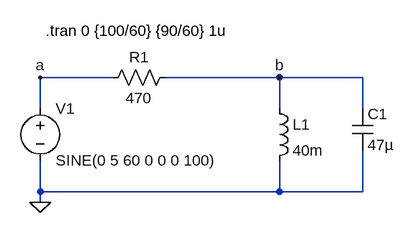
[diagram p0: schematic RLC.asc]
RLC.asc, the LTspice schematic file:
Version 4
SHEET 1 880 680
WIRE 128 64 16 64
WIRE 384 64 208 64
WIRE 512 64 384 64
WIRE 16 112 16 64
WIRE 384 112 384 64
WIRE 512 112 512 64
WIRE 16 240 16 192
WIRE 384 240 384 192
WIRE 384 240 16 240
WIRE 512 240 512 176
WIRE 512 240 384 240
WIRE 16 256 16 240
FLAG 16 64 a
FLAG 384 64 b
FLAG 16 256 0
SYMBOL voltage 16 96 R0
WINDOW 123 0 0 Left 0
WINDOW 39 0 0 Left 0
SYMATTR InstName V1
SYMATTR Value SINE(0 5 60 0 0 0 100)
SYMBOL res 224 48 R90
WINDOW 0 0 56 VBottom 2
WINDOW 3 32 56 VTop 2
SYMATTR InstName R1
SYMATTR Value 470
SYMBOL ind 368 96 R0
SYMATTR InstName L1
SYMATTR Value 40m
SYMBOL cap 496 112 R0
SYMATTR InstName C1
SYMATTR Value 47µ
TEXT 24 -8 Left 2 !.tran 0 {100/60} {90/60} 1u

The netlist it stands for:
* RLC.asc
V1 a 0 SINE(0 5 60 0 0 0 100)
R1 b a 470
L1 b 0 40m
C1 b 0 47µ
.tran 0 {100/60} {90/60} 1u
.backanno
.end